# EAGLE design ansible (EAGLE 7.6.0)
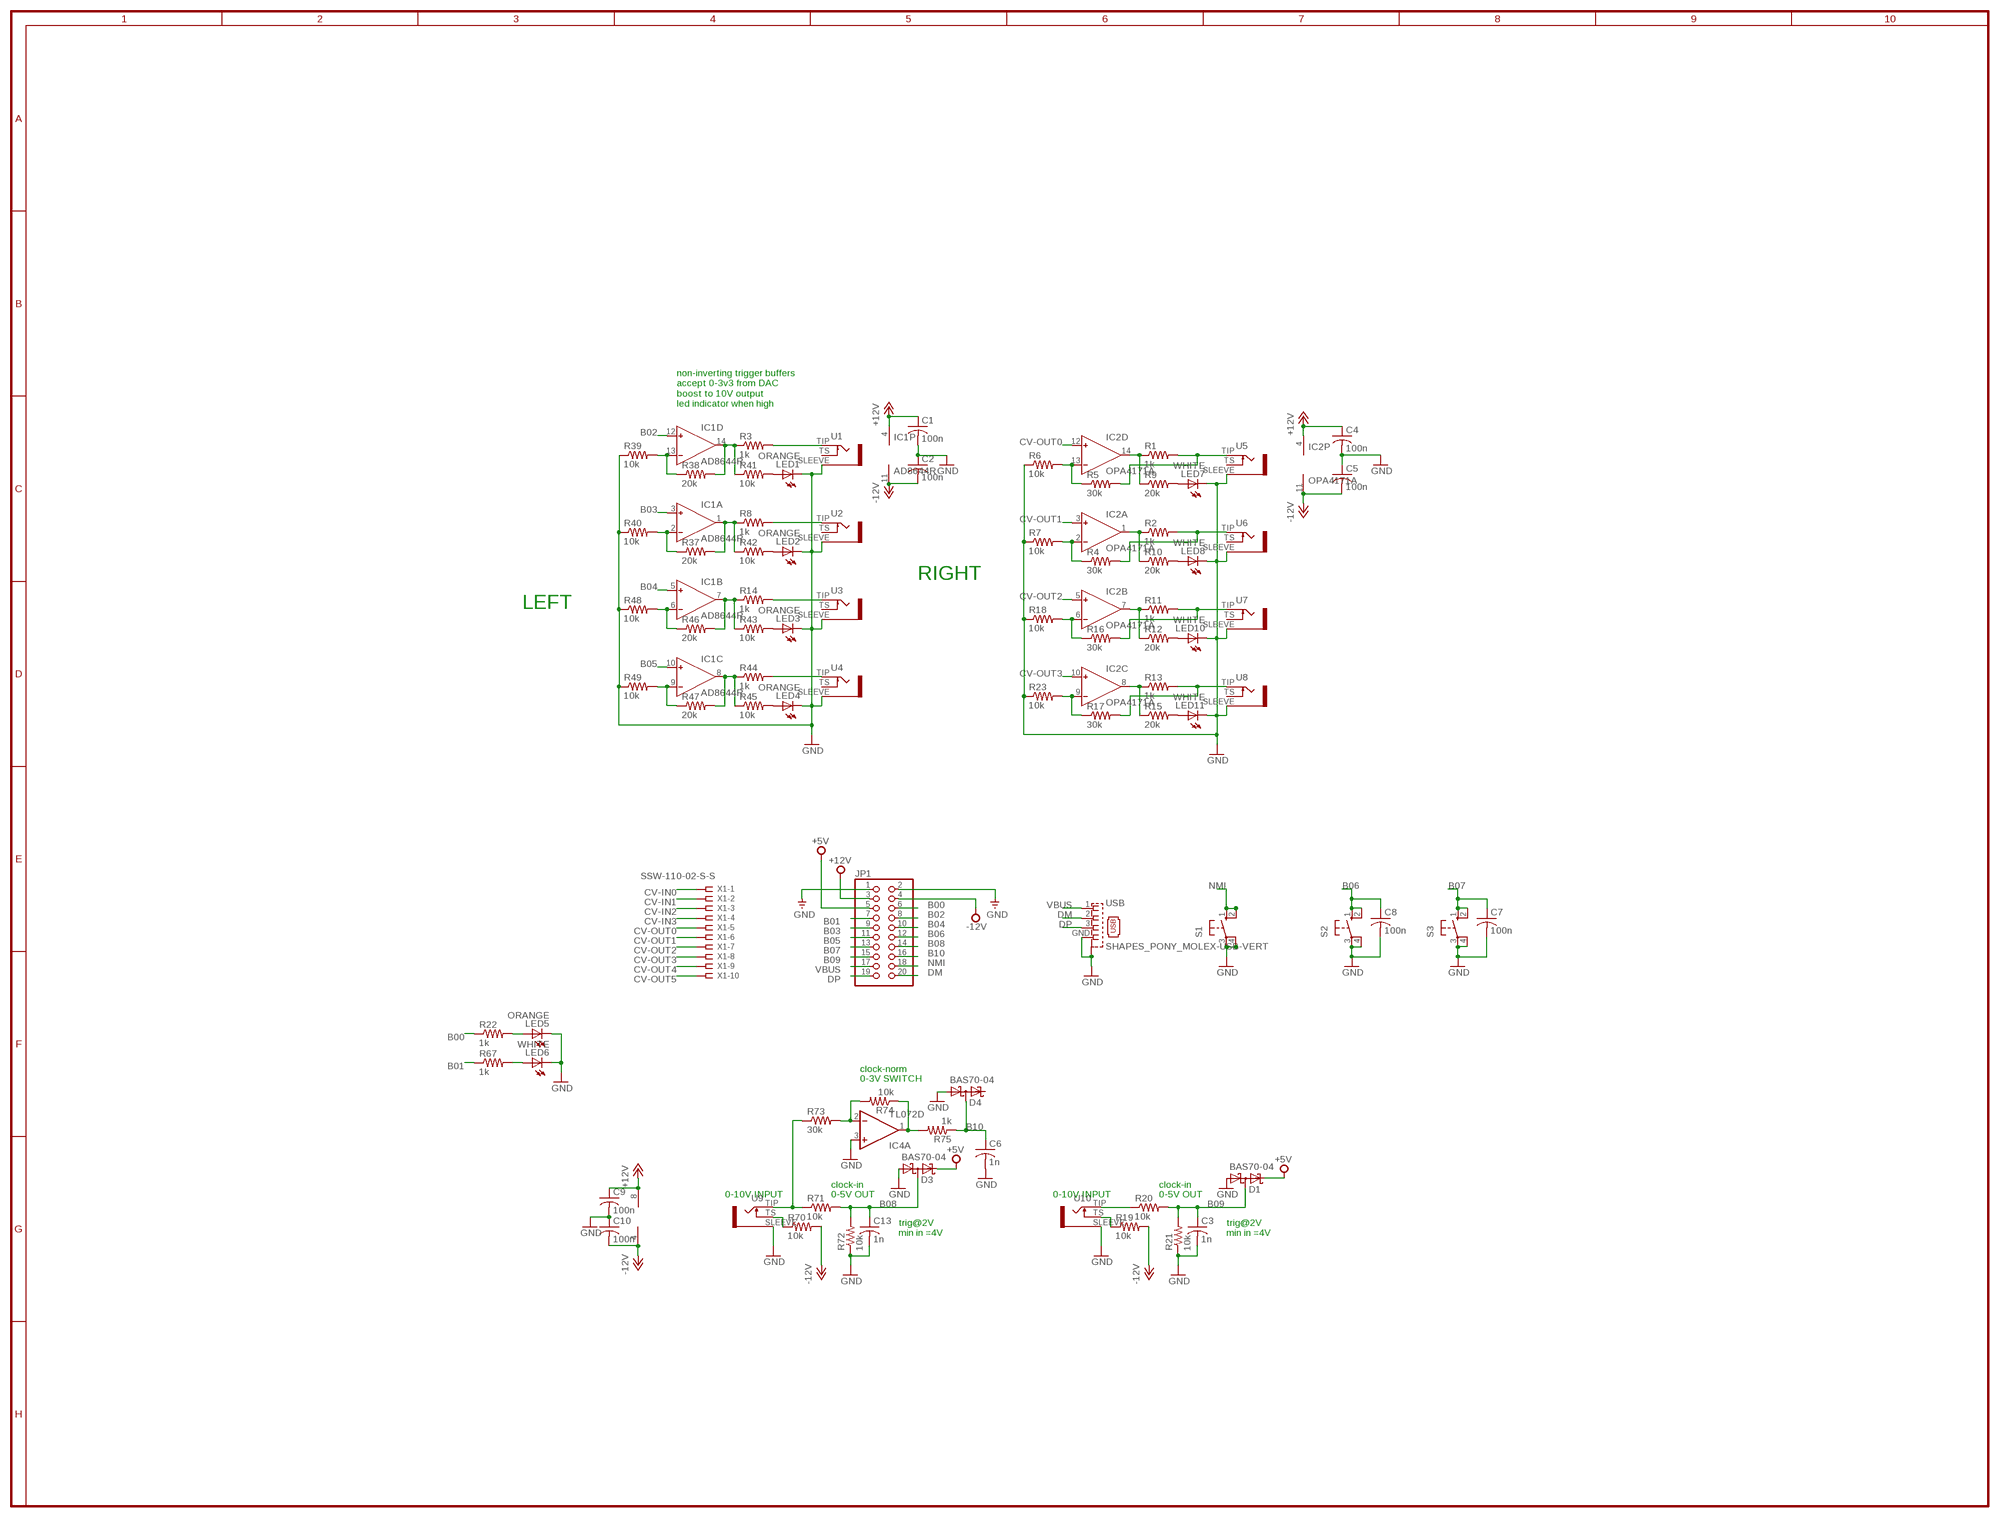
[diagram p0: schematic, sheet 1]

## Parts
C1  100n  C-USC0402  [C0402]
C2  100n  C-USC0402  [C0402]
C3  1n  C-USC0402  [C0402]
C4  100n  C-USC0402  [C0402]
C5  100n  C-USC0402  [C0402]
C6  1n  C-USC0402  [C0402]
C7  100n  C-USC0402  [C0402]
C8  100n  C-USC0402  [C0402]
C9  100n  C-USC0402  [C0402]
C10  100n  C-USC0402  [C0402]
C13  1n  C-USC0402  [C0402]
D1  BAS70-04  [SOT23]
D3  BAS70-04  [SOT23]
D4  BAS70-04  [SOT23]
IC1  AD8644R  [SO14]
IC2  OPA4171A  AD8644R  [SO14]
IC4  TL072D  [SO08]
JP1  PINHD-2X10  [2X10]
LED1  ORANGE  LEDCHIP-LED0603  [CHIP-LED0603]
LED2  ORANGE  LEDCHIP-LED0603  [CHIP-LED0603]
LED3  ORANGE  LEDCHIP-LED0603  [CHIP-LED0603]
LED4  ORANGE  LEDCHIP-LED0603  [CHIP-LED0603]
LED5  ORANGE  LEDCHIP-LED0603  [CHIP-LED0603]
LED6  WHITE  LEDCHIP-LED0603  [CHIP-LED0603]
LED7  WHITE  LEDCHIP-LED0603  [CHIP-LED0603]
LED8  WHITE  LEDCHIP-LED0603  [CHIP-LED0603]
LED10  WHITE  LEDCHIP-LED0603  [CHIP-LED0603]
LED11  WHITE  LEDCHIP-LED0603  [CHIP-LED0603]
R1  1k  R-US_R0402  [R0402]
R2  1k  R-US_R0402  [R0402]
R3  1k  R-US_R0402  [R0402]
R4  30k  R-US_R0402  [R0402]
R5  30k  R-US_R0402  [R0402]
R6  10k  R-US_R0402  [R0402]
R7  10k  R-US_R0402  [R0402]
R8  1k  R-US_R0402  [R0402]
R9  20k  R-US_R0402  [R0402]
R10  20k  R-US_R0402  [R0402]
R11  1k  R-US_R0402  [R0402]
R12  20k  R-US_R0402  [R0402]
R13  1k  R-US_R0402  [R0402]
R14  1k  R-US_R0402  [R0402]
R15  20k  R-US_R0402  [R0402]
R16  30k  R-US_R0402  [R0402]
R17  30k  R-US_R0402  [R0402]
R18  10k  R-US_R0402  [R0402]
R19  10k  R-US_R0402  [R0402]
R20  10k  R-US_R0402  [R0402]
R21  10k  R-US_R0402  [R0402]
R22  1k  R-US_R0402  [R0402]
R23  10k  R-US_R0402  [R0402]
R37  20k  R-US_R0402  [R0402]
R38  20k  R-US_R0402  [R0402]
R39  10k  R-US_R0402  [R0402]
R40  10k  R-US_R0402  [R0402]
R41  10k  R-US_R0402  [R0402]
R42  10k  R-US_R0402  [R0402]
R43  10k  R-US_R0402  [R0402]
R44  1k  R-US_R0402  [R0402]
R45  10k  R-US_R0402  [R0402]
R46  20k  R-US_R0402  [R0402]
R47  20k  R-US_R0402  [R0402]
R48  10k  R-US_R0402  [R0402]
R49  10k  R-US_R0402  [R0402]
R67  1k  R-US_R0402  [R0402]
R70  10k  R-US_R0402  [R0402]
R71  10k  R-US_R0402  [R0402]
R72  10k  R-US_R0402  [R0402]
R73  30k  R-US_R0402  [R0402]
R74  10k  R-US_R0402  [R0402]
R75  1k  R-US_R0402  [R0402]
S1  10-XX  [B3F-10XX]
S2  10-XX  [B3F-10XX]
S3  10-XX  [B3F-10XX]
U1  WQP-PJ301M-12_JACK  [WQP-PJ301M-12_JACK]
U2  WQP-PJ301M-12_JACK  [WQP-PJ301M-12_JACK]
U3  WQP-PJ301M-12_JACK  [WQP-PJ301M-12_JACK]
U4  WQP-PJ301M-12_JACK  [WQP-PJ301M-12_JACK]
U5  WQP-PJ301M-12_JACK  [WQP-PJ301M-12_JACK]
U6  WQP-PJ301M-12_JACK  [WQP-PJ301M-12_JACK]
U7  WQP-PJ301M-12_JACK  [WQP-PJ301M-12_JACK]
U8  WQP-PJ301M-12_JACK  [WQP-PJ301M-12_JACK]
U9  WQP-PJ301M-12_JACK  [WQP-PJ301M-12_JACK]
U10  WQP-PJ301M-12_JACK  [WQP-PJ301M-12_JACK]
USB  SHAPES_PONY_MOLEX-USB-VERT  [SHAPES_PONY_MOLEX-USB]
X1  SSW-110-02-S-S  [SSW-110-02-S-S]

## Nets
+5V: D1.2(C2) D3.2(C2) JP1.5
+12V: C1.1 C4.1 C9.1 IC1.4(P:V+) IC2.4(P:V+) IC4.8(P:V+) JP1.3
-12V: C2.2 C5.2 C10.2 IC1.11(P:V-) IC2.11(P:V-) IC4.4(P:V-) JP1.4 R19.2 R70.2
B00: JP1.6 R22.1
B01: JP1.7 R67.1
B02: IC1.12(D:IN+) JP1.8
B03: IC1.3(A:IN+) JP1.9
B04: IC1.5(B:IN+) JP1.10
B05: IC1.10(C:IN+) JP1.11
B06: C8.1 JP1.12 S2.1(S) S2.2(S1)
B07: C7.1 JP1.13 S3.1(S) S3.2(S1)
B08: C13.1 D3.3(C1A2) JP1.14 R71.2 R72.2
B09: C3.1 D1.3(C1A2) JP1.15 R20.2 R21.2
B10: C6.1 D4.3(C1A2) JP1.16 R75.1
CV-IN0: X1.1
CV-IN1: X1.2
CV-IN2: X1.3
CV-IN3: X1.4
CV-OUT0: IC2.12(D:IN+) X1.5
CV-OUT1: IC2.3(A:IN+) X1.6
CV-OUT2: IC2.5(B:IN+) X1.7
CV-OUT3: IC2.10(C:IN+) X1.8
CV-OUT4: X1.9
CV-OUT5: X1.10
DM: JP1.20 USB.2
DP: JP1.19 USB.3
GND: C1.2 C2.1 C3.2 C4.2 C5.1 C6.2 C7.2 C8.2 C9.2 C10.1 C13.2 D1.1(A1) D3.1(A1) D4.1(A1) IC4.3(A:+IN) JP1.1 JP1.2 LED1.C LED2.C LED3.C LED4.C LED5.C LED6.C LED7.C LED8.C LED10.C LED11.C R6.1 R7.1 R18.1 R21.1 R23.1 R39.1 R40.1 R48.1 R49.1 R72.1 S1.3(P) S1.4(P1) S2.3(P) S2.4(P1) S3.3(P) S3.4(P1) U1.SLEEVE U2.SLEEVE U3.SLEEVE U4.SLEEVE U5.SLEEVE U6.SLEEVE U7.SLEEVE U8.SLEEVE U9.SLEEVE U10.SLEEVE USB.GND USB.M1(S1) USB.M2(S1) USB.M4(S1)
N: IC4.1(A:OUT) R74.1 R75.2
N$1: IC4.2(A:-IN) R73.2 R74.2
N$2: IC1.14(D:OUT) R3.1 R38.2 R41.1
N$3: IC1.1(A:OUT) R8.1 R37.2 R42.1
N$4: IC1.7(B:OUT) R14.1 R43.1 R46.2
N$5: IC1.8(C:OUT) R44.1 R45.1 R47.2
N$6: R3.2 U1.TIP
N$7: R8.2 U2.TIP
N$8: R14.2 U3.TIP
N$9: R44.2 U4.TIP
N$10: R20.1 U10.TIP
N$11: IC2.14(D:OUT) R1.1 R9.1
N$12: IC2.1(A:OUT) R2.1 R10.1
N$13: IC2.7(B:OUT) R11.1 R12.1
N$14: IC2.8(C:OUT) R13.1 R15.1
N$15: LED5.A R22.2
N$19: R13.2 R17.2 U8.TIP
N$20: IC2.13(D:IN-) R5.1 R6.2
N$21: IC2.2(A:IN-) R4.1 R7.2
N$22: LED7.A R9.2
N$23: LED8.A R10.2
N$24: R70.1 U9.TS
N$25: R19.1 U10.TS
N$26: IC2.9(C:IN-) R17.1 R23.2
N$27: IC2.6(B:IN-) R16.1 R18.2
N$28: LED10.A R12.2
N$29: LED11.A R15.2
N$30: R1.2 R5.2 U5.TIP
N$31: R2.2 R4.2 U6.TIP
N$32: R11.2 R16.2 U7.TIP
N$57: IC1.9(C:IN-) R47.1 R49.2
N$58: IC1.6(B:IN-) R46.1 R48.2
N$61: R71.1 R73.1 U9.TIP
N$62: IC1.13(D:IN-) R38.1 R39.2
N$63: IC1.2(A:IN-) R37.1 R40.2
N$64: LED6.A R67.2
N$67: LED1.A R41.2
N$68: LED2.A R42.2
N$70: LED3.A R43.2
N$71: LED4.A R45.2
NMI: JP1.18 S1.1(S) S1.2(S1)
VBUS: JP1.17 USB.1
Unconnected: D4.2(C2) IC4.5(B:+IN) IC4.6(B:-IN) IC4.7(B:OUT) U1.TS U2.TS U3.TS U4.TS U5.TS U6.TS U7.TS U8.TS

## Notes on the sheet
- non-inverting trigger buffers
  accept 0-3v3 from DAC
  boost to 10V output
  led indicator when high
- RIGHT
- LEFT
- clock-norm
- 0-3V SWITCH
- clock-in | clock-in
- 0-10V INPUT | 0-5V OUT | 0-10V INPUT | 0-5V OUT
- trig@2V
  min in =4V
- trig@2V
  min in =4V

## Library data of the parts
C1-C10 C13 = rcl:C-US: CAPACITOR, American symbol
D1 D3 D4 = diode:BAS70-04: Silicon Schottky Diodes General-purpose diode for high-speed switching
IC1 IC2 = analog-devices:AD8644: Single and Quad 18 V Operational Amplifiers Source: http://www.analog.com/static/imported-files/data_sheets/AD8614_8644.pdf; MF: ALTERA CORPORATION; MPN: AD8644ARZ; OC_FARNELL: 1438873; OC_NEWARK: 59K7037
IC4 = linear:TL072: OP AMP
JP1 = pinhead:PINHD-2X10: PIN HEADER
LED1-LED8 LED10 LED11 = led:LED: LED OSRAM: - CHIPLED LG R971, LG N971, LY N971, LG Q971, LY Q971, LO R971, LY R971 LH N974, LH R974 LS Q976, LO Q976, LY Q976 LO Q996 - Hyper CHIPLED LW Q18S LB Q993, LB Q99A, LB R99A - SideLED LS A670, LO A670, LY A670, LG A670, LP A670 LB A673, LV A673, LT A673, LW A673 LH A674 LY A675 LS A676, LA A676, LO A676, LY A676, LW A676 LS A679, LY A679, LG A679 - Hyper Micro SIDELED® LS Y876, LA Y876, LO Y876, LY Y876 LT Y87S - SmartLED LW L88C, LW L88S LB L89C, LB L89S, LG L890 LS L89K, LO L89K, LY L89K LS L896, LA L896, LO L896, LY L896 - TOPLED LS T670, LO T670, LY T670, LG T670, LP T670 LSG T670, LSP T670, LSY T670, LOP T670, LYG T670 LG T671, LOG T671, LSG T671 LB T673, LV T673, LT T673, LW T673 LH T674 LS T676, LA T676, LO T676, LY T676, LB T676, LH T676, LSB T676, LW T676 LB T67C, LV T67C, LT T67C, LS T67K, LO T67K, LY T67K, LW E67C LS E67B, LA E67B, LO E67B, LY E67B, LB E67C, LV E67C, LT E67C LW T67C LS T679, LY T679, LG T679 LS T770, LO T770, LY T770, LG T770, LP T770 LB T773, LV T773, LT T773, LW T773 LH T774 LS E675, LA E675, LY E675, LS T675 LS T776, LA T776, LO T776, LY T776, LB T776 LHGB T686 LT T68C, LB T68C - Hyper Mini TOPLED® LB M676 - Mini TOPLED Santana® LG M470 LS M47K, LO M47K, LY M47K Source: http://www.osram.convergy.de LUXEON: - LUMILED® LXK2-PW12-R00, LXK2-PW12-S00, LXK2-PW14-U00, LXK2-PW14-V00 LXK2-PM12-R00, LXK2-PM12-S00, LXK2-PM14-U00 LXK2-PE12-Q00, LXK2-PE12-R00, LXK2-PE12-S00, LXK2-PE14-T00, LXK2-PE14-U00 LXK2-PB12-K00, LXK2-PB12-L00, LXK2-PB12-M00, LXK2-PB14-N00, LXK2-PB14-P00, LXK2-PB14-Q00 LXK2-PR12-L00, LXK2-PR12-M00, LXK2-PR14-Q00, LXK2-PR14-R00 LXK2-PD12-Q00, LXK2-PD12-R00, LXK2-PD12-S00 LXK2-PH12-R00, LXK2-PH12-S00 LXK2-PL12-P00, LXK2-PL12-Q00, LXK2-PL12-R00 Source: www.luxeon.com KINGBRIGHT: KA-3528ASYC Source: www.kingbright.com
R1-R23 R37-R49 R67 R70-R75 = rcl:R-US_: RESISTOR, American symbol
S1-S3 = switch-omron:10-XX: OMRON SWITCH; MPN: B3F-1000; OC_FARNELL: 176432; OC_NEWARK: 36M3542
U1-U10 = thonkiconn:WQP-PJ301M-12_JACK
USB = monome_modular:SHAPES_PONY_MOLEX-USB-VERT
X1 = con-samtec:SSW-110-02-S-S: THROUGH-HOLE .025" SQ POST SOCKET Source: Samtec SSW.pdf; MPN: SSW-110-02-S-S; OC_FARNELL: unknown; OC_NEWARK: 11P9482

## Board
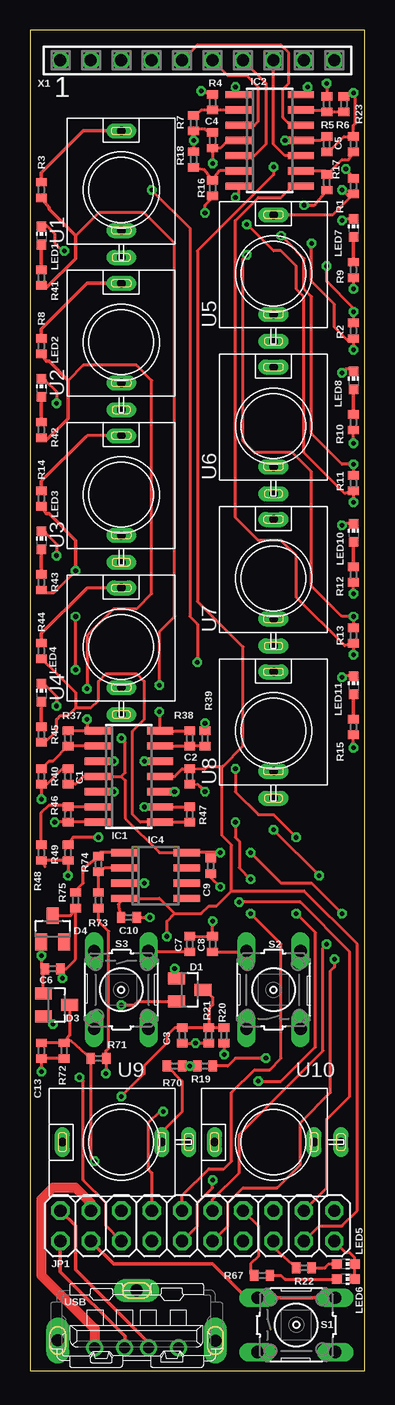
[diagram p1: board, top side]
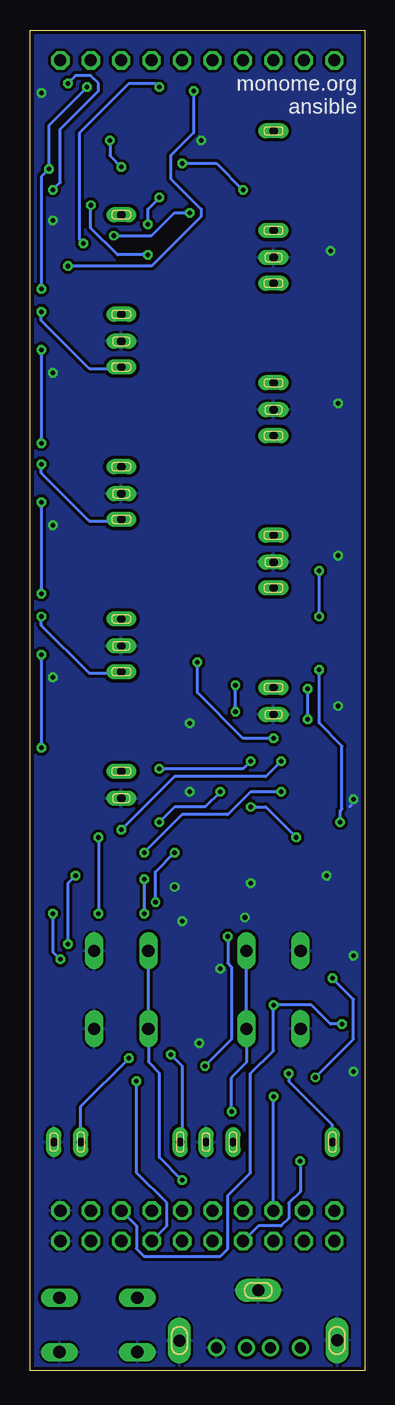
[diagram p2: board, bottom side, seen from below]

Size 27.94 x 111.76 mm. Coordinates in mm from the lower left corner, seen from the top.
Outline: 0,0 27.94,0 27.94,111.76 0,111.76 0,0
Copper layers (1*16): Top 0.035mm / dielectric 1.5mm / Bottom 0.035mm
Design rules "default *": minimum track width 10mil, minimum drill 15mil, track to track 6mil, track to pad 6mil, pad to pad 6mil, via to via 6mil, smd to smd 0mil, copper to edge 12mil, drill to drill 8mil, minimum pad ring 10mil, minimum via ring 8mil, stop-mask expansion 4mil, vias tented up to drill 0mil, thermal gap 8mil

### Footprints (pad centres in the part's own frame; a part is rotated, then mirrored left to right if it is on the bottom)
C0402 = smd 0.7 x 0.9: 1 -0.65,0; 2 0.65,0
SOT23 = smd 1 x 1.4: 1 -0.95,-1.1; 2 0.95,-1.1; 3 0,1.1
SO14 = smd 0.6 x 2.2: 1 -3.81,-2.6; 2 -2.54,-2.6; 3 -1.27,-2.6; 4 0,-2.6; 5 1.27,-2.6; 6 2.54,-2.6; 7 3.81,-2.6; 8 3.81,2.6; 9 2.54,2.6; 10 1.27,2.6; 11 0,2.6; 12 -1.27,2.6; 13 -2.54,2.6; 14 -3.81,2.6
SO08 = smd 0.6 x 2.2: 1 -1.905,-2.6; 2 -0.635,-2.6; 3 0.635,-2.6; 4 1.905,-2.6; 5 1.905,2.6; 6 0.635,2.6; 7 -0.635,2.6; 8 -1.905,2.6
2X10 = drill 1.016 octagon: 1 -11.43,-1.27; 2 -11.43,1.27; 3 -8.89,-1.27; 4 -8.89,1.27; 5 -6.35,-1.27; 6 -6.35,1.27; 7 -3.81,-1.27; 8 -3.81,1.27; 9 -1.27,-1.27; 10 -1.27,1.27; 11 1.27,-1.27; 12 1.27,1.27; 13 3.81,-1.27; 14 3.81,1.27; 15 6.35,-1.27; 16 6.35,1.27; 17 8.89,-1.27; 18 8.89,1.27; 19 11.43,-1.27; 20 11.43,1.27
CHIP-LED0603 = smd 0.8 x 0.8: A 0,-0.75; C 0,0.75
R0402 = smd 0.7 x 0.9: 1 -0.65,0; 2 0.65,0
B3F-10XX = drill 1.016 long: 1 -3.251,2.261; 2 3.251,2.261; 3 -3.251,-2.261; 4 3.251,-2.261
WQP-PJ301M-12_JACK = drill 0.7 pad 1.27 long: SLEEVE 0,-5.63; TIP 0,4.92; TS 0,-3.38
SHAPES_PONY_MOLEX-USB = drill 0.9 pad 1.3: 1 -3.5,-1.9; 2 -1,-1.9; 3 1,-1.9; GND 3.5,-1.9 | drill 1 pad 1.9 long: M1 -6.575,-1.295; M2 6.575,-1.305; M4 0,2.88
SSW-110-02-S-S = drill 1 pad 1.5 octagon: 1 -11.43,0; 2 -8.89,0; 3 -6.35,0; 4 -3.81,0; 5 -1.27,0; 6 1.27,0; 7 3.81,0; 8 6.35,0; 9 8.89,0; 10 11.43,0

### Placement (x,y rotation side)
C1  3.17,49.53 90 top
C2  13.34,49.53 90 top
C3  12.7,27.94 270 top
C4  15.24,102.55 90 top
C5  24.77,102.23 90 top
C6  1.91,33.5 180 top
C7  13.34,35.56 90 top
C8  15.24,35.56 90 top
C9  15.08,42.07 270 top
C10  8.26,37.78 180 top
C13  0.95,26.67 270 top
D1  13.34,31.75 270 top
D3  2.22,30.48 270 top
D4  1.91,36.83 0 top
IC1  8.26,49.53 270 top
IC2  20,102.55 270 top
IC4  10.48,41.27 270 top
JP1  13.97,12.06 180 top
LED1  0.95,94.61 0 top
LED2  0.95,81.92 0 top
LED3  0.95,69.22 0 top
LED4  0.95,56.52 0 top
LED5  26.35,8.89 270 top
LED6  26.35,7.62 270 top
LED7  26.99,95.25 0 top
LED8  26.99,82.55 0 top
LED10  26.99,69.85 0 top
LED11  26.99,57.15 0 top
R1  26.99,98.74 270 top
R2  26.99,86.68 90 top
R3  0.95,98.42 90 top
R4  15.24,105.73 90 top
R5  24.77,105.57 90 top
R6  26.19,105.57 270 top
R7  13.65,103.98 90 top
R8  0.95,85.41 90 top
R9  26.99,91.76 90 top
R10  26.99,79.06 90 top
R11  26.99,73.98 90 top
R12  26.99,66.36 90 top
R13  26.99,61.28 90 top
R14  0.95,72.71 90 top
R15  26.99,53.66 90 top
R16  15.24,98.58 270 top
R17  24.77,99.06 270 top
R18  13.65,100.97 270 top
R19  14.61,25.4 180 top
R20  16.19,27.94 90 top
R21  14.92,27.94 90 top
R22  22.86,8.57 0 top
R23  26.99,102.23 270 top
R37  3.17,52.7 90 top
R38  13.34,52.7 90 top
R39  14.61,52.7 270 top
R40  0.95,49.53 90 top
R41  0.95,91.12 90 top
R42  0.95,78.42 90 top
R43  0.95,65.72 90 top
R44  0.95,60.01 90 top
R45  0.95,53.02 90 top
R46  3.17,46.35 270 top
R47  13.34,46.35 270 top
R48  0.95,43.18 90 top
R49  3.17,43.18 90 top
R67  19.37,7.94 0 top
R70  12.06,25.4 0 top
R71  5.71,26.04 180 top
R72  2.86,26.67 90 top
R73  5.71,39.21 90 top
R74  5.71,42.23 270 top
R75  3.81,39.21 90 top
S1  22.23,3.81 0 top
S2  20.32,31.75 90 top
S3  7.62,31.75 270 top
U1  7.62,98.42 0 top
U2  7.62,85.72 0 top
U3  7.62,73.03 0 top
U4  7.62,60.33 0 top
U5  20.32,91.44 0 top
U6  20.32,78.74 0 top
U7  20.32,66.04 0 top
U8  20.32,53.34 0 top
U9  7.62,19.05 90 top
U10  20.32,19.05 90 top
USB  8.89,3.81 0 top
X1  13.97,109.22 0 top

### Tracks (layer width: path | path; a pad name or v marks a point on that pad's centre or on a via)
+5V  (via drill 0.38)
  Top 0.254: D3.2 1.12,29.38 v1.91,28.89 | v7.62,30.48 8.73,30.48 9.05,30.8 D1.2
  Bottom 0.254: v1.91,28.89 2.86,28.89 4.45,30.48 v7.62,30.48 7.62,26.67 9.53,24.77 9.53,16.51 11.43,14.61 11.43,10.16 12.06,9.53 18.41,9.53 19.05,10.16 19.05,12.06 JP1.5
+12V  (via drill 0.38)
  Top 0.254: IC2.4 16.51,102.55 15.88,101.92 15.46,101.92 C4.1 v15.24,100.65 | v10.16,98.42 13.34,95.25 13.34,62.87 13.97,62.23 v13.97,59.05 | C9.1 14.87,42.92 14.61,43.18 | 14.61,43.18 IC4.8 10.79,43.18 7.94,46.04 7.94,49.21 7.62,49.53 | 7.62,49.53 IC1.4 4.45,49.53 3.81,48.9 3.19,48.9 C1.1 | 7.62,49.53 7.94,49.85 7.94,52.39 v7.62,52.7 | JP1.3 24.77,15.24 24.77,20.95 26.67,22.86 26.67,34.92 22.54,39.05 v17.46,39.05 | v15.88,43.18 14.61,43.18
  Bottom 0.254: v15.24,100.65 12.38,100.65 v10.16,98.42 | v7.62,52.7 10.16,52.7 13.97,56.52 v13.97,59.05 | v17.46,39.05 17.46,41.59 v15.88,43.18
-12V  (via drill 0.38)
  Top 0.254: IC1.11 12.06,49.53 12.7,50.16 13.12,50.16 C2.2 14.61,50.16 14.82,50.38 16.03,50.38 | C5.2 24.23,102.55 IC2.11 v21.27,102.55 | v20.32,100.33 20.32,99.69 13.97,93.34 13.97,64.14 17.78,60.33 17.78,52.07 16.09,50.38 16.03,50.38 | C10.2 7.41,38.9 IC4.4 10.79,39.37 12.06,38.1 | 12.06,38.1 14.29,38.1 14.92,38.73 15.56,38.73 16.83,40.01 | 16.83,40.01 16.83,43.81 16.03,44.61 16.03,50.38 | JP1.4 24.13,12.06 26.04,12.06 27.3,13.34 27.3,35.56 22.86,40.01 16.83,40.01 | v11.43,36.2 11.43,37.47 12.06,38.1 | R19.2 v13.34,25.4 R70.2
  Bottom 0.254: v21.27,102.55 21.27,101.28 v20.32,100.33 | v11.43,36.2 11.43,33.97 11.11,33.66 11.11,27.62 v13.34,25.4
B00
  Top 0.254: JP1.6 20.42,10.16 R22.1
B01
  Top 0.254: JP1.7 19.05,12.06 19.05,9.53 18.41,8.89 18.41,8.04 R67.1
B02  (via drill 0.38)
  Top 0.254: IC1.12 v9.53,50.8 | v17.14,50.16 17.14,48.26 19.05,46.35 20.32,46.35 v22.23,44.45 | v19.05,24.13 20.95,24.13 23.81,26.99 23.81,36.51 v22.23,38.1
  Bottom 0.254: v9.53,50.8 10.16,50.16 v17.14,50.16 | JP1.8 16.51,12.06 16.51,13.97 19.05,16.51 v19.05,24.13 | v22.23,44.45 v22.23,38.1
B03  (via drill 0.38)
  Top 0.254: IC1.3 v6.99,50.8 | JP1.9 15.24,14.29 17.46,16.51 17.46,19.68 24.45,26.67 24.45,35.24 v24.77,35.56 | v20.32,45.09 v24.13,41.27
  Bottom 0.254: v6.99,50.8 8.26,49.53 15.88,49.53 v20.32,45.09 | v24.77,35.56 24.77,40.64 v24.13,41.27
B04  (via drill 0.38)
  Top 0.254: IC1.5 v6.99,48.26 | JP1.10 16.51,12.06 16.51,13.97 17.78,15.24 20.64,15.24 22.54,17.14 22.54,20.64 25.08,23.18 25.08,33.34 25.4,33.66 v25.4,34.29 | v18.41,43.18 20.95,40.64 23.5,40.64 v26.04,38.1
  Bottom 0.254: v6.99,48.26 9.53,48.26 11.43,46.35 15.24,46.35 v18.41,43.18 | v26.04,38.1 26.04,34.92 v25.4,34.29
B05  (via drill 0.38)
  Top 0.254: IC1.10 v12.06,48.26 | JP1.11 12.7,14.61 14.92,16.83 16.19,16.83 16.83,17.46 16.83,23.18 18.73,25.08 20,25.08 20.95,26.04 20.95,35.56 v18.41,38.1 | v17.14,45.72 17.14,44.45 17.46,44.13 17.46,41.91 v18.41,40.96
  Bottom 0.254: v12.06,48.26 13.34,46.99 15.88,46.99 v17.14,45.72 | v18.41,40.96 v18.41,38.1
B06  (via drill 0.38)
  Top 0.254: JP1.12 13.97,12.06 13.97,13.97 15.24,15.24 v15.24,15.88 | C8.1 17.97,34.91 S2.2
  Bottom 0.254: S2.2 S2.1 18.06,25.76 17.14,24.77 17.14,17.78 v15.24,15.88
B07  (via drill 0.38)
  Top 0.254: v11.11,21.59 10.79,21.59 9.84,20.64 9.84,16.83 10.16,16.51 JP1.13 | C7.1 9.97,34.91 S3.1
  Bottom 0.254: S3.1 S3.2 9.88,25.68 11.11,24.45 v11.11,21.59
B08  (via drill 0.38)
  Top 0.254: R72.2 C13.1 | D3.3 3.32,27.98 R72.2 | R72.2 3.38,27.52 R71.2 5.08,26.02 5.08,17.78 v5.4,17.46
  Bottom 0.254: v5.4,17.46 5.4,14.92 6.35,13.97 6.35,12.7 6.99,12.06 8.89,12.06 JP1.14
B09  (via drill 0.38)
  Top 0.254: R21.2 C3.1 12.08,28.59 11.43,27.94 11.43,27.3 9.53,25.4 9.53,24.77 v7.62,22.86 | D1.3 14.61,31.75 15.24,31.11 15.24,30.48 14.92,30.16 R21.2 | R20.2 R21.2
  Bottom 0.254: JP1.15 v7.62,22.86
B10  (via drill 0.38)
  Top 0.254: D4.3 3.38,37.93 R75.1 3.81,34.29 3.02,33.5 C6.1 2.7,33.44 v2.7,32.7 | JP1.16 6.35,12.06 6.35,13.97 4.45,15.88 4.45,24.13 v4.13,24.45
  Bottom 0.254: v4.13,24.45 0.95,27.62 0.95,30.96 v2.7,32.7
CV-OUT0
  Top 0.254: IC2.12 21.75,103.82 21.11,104.46 21.11,106.84 21.59,107.31 21.59,109.86 20.95,110.49 13.97,110.49 X1.5
CV-OUT1
  Top 0.254: IC2.3 18.73,103.82 19.05,104.14 19.05,107 18.1,107.95 16.51,107.95 X1.6
CV-OUT2
  Top 0.254: X1.7 19.68,107.31 19.68,102.23 18.73,101.28 IC2.5
CV-OUT3
  Top 0.254: IC2.10 21.27,101.28 20.32,102.23 X1.8
DM
  Top 0.305: JP1.20 2.54,8.26 7.94,2.86 7.94,1.96 USB.2
DP
  Top 0.305: JP1.19 3.81,12.06 3.81,8.41 9.84,2.38 9.84,1.96 USB.3
GND  (via drill 0.38)
  Top 0.254: 1.27,42.01 R48.1 R49.1 v3.17,41.27 | C2.1 13.97,48.9 14.19,48.68 14.23,48.68 v14.61,48.26 | C1.2 2.96,50.16 2.7,50.16 1.21,48.68 R40.1 v0.95,47.62 | LED4.C 0.85,57.56 2.22,56.2 v2.22,55.4 | LED3.C 1.17,70.27 1.27,69.85 2.22,68.9 v2.22,67.94 | LED2.C 1.17,82.97 1.27,82.55 2.22,81.6 v2.22,80.64 | LED1.C 1.17,95.67 2.06,94.77 2.06,93.98 2.7,93.34 v2.86,93.34 | LED8.C 26.99,83.5 26.35,83.5 v26.04,83.19 | R6.1 26.89,106.42 v26.99,106.52 27.15,106.36 27.15,103.98 26.99,103.82 R23.1 26.77,102.87 26.19,102.87 24.77,101.44 C5.1 | LED6.C LED5.C 27.1,9.41 26.67,9.84 26.35,9.84 JP1.2 | C4.2 14.91,103.2 14.61,103.5 13.97,103.5 13.92,103.4 R7.1 v13.65,102.55 R18.1 13.44,101.6 | IC4.3 v9.53,40.64 | C9.2 15.08,41.12 v15.88,40.32 | 9.21,37.78 C10.1 v10,37.78 | D3.1 1.12,33.43 C6.2 0.95,33.6 v0.95,34.61 D4.1 | v0.95,24.92 C13.2 R72.1 | D1.1 12.23,33.33 v12.06,33.5 | v15.24,37.47 C8.2 C7.2 | C3.2 13.8,27.29 v13.81,27.3 13.83,27.29 R21.1 | R39.1 v14.61,53.98 | LED11.C 26.15,57.9 v26.04,57.78 | LED10.C 26.15,70.6 v26.04,70.48 | LED7.C 26.15,96 v26.04,95.89
  Bottom 0.254: 1.11,47.15 1.27,46.99
  pour Bottom (isolate 0.254): 0,0 27.94,0 27.94,111.76 0,111.76
N
  Top 0.254: R75.2 3.87,40.06 4.45,40.64 4.45,41.81 R74.1 5.82,43.18 IC4.1
N$1
  Top 0.254: IC4.2 6.25,41.91 R74.2 R73.2
N$2  (via drill 0.38)
  Top 0.254: R38.2 13.12,53.34 IC1.14 10.79,53.4 v10.79,54.93 | v10.79,57.15 10.79,61.59 12.06,62.87 12.06,93.98 9.53,96.52 5.71,96.52 3.81,94.61
  Top 0.305: R41.1 1.37,90.27 3.81,92.71 3.81,94.61 1.59,96.84 1.59,96.94 R3.1
  Bottom 0.254: v10.79,54.93 v10.79,57.15
N$3  (via drill 0.38)
  Top 0.254: IC1.1 5.08,53.34 | 5.08,53.34 3.39,53.34 R37.2 | v4.76,56.83 4.76,61.28 6.99,63.5 8.89,63.5 10.16,64.77 10.16,82.55 8.89,83.82 4.45,83.82 3.17,82.55 | v4.76,54.29 4.76,53.66 5.08,53.34
  Top 0.305: R42.1 1.37,77.57 3.17,79.38 3.17,82.55 1.59,84.14 1.37,84.14 R8.1
  Bottom 0.254: v4.76,54.29 v4.76,56.83
N$4  (via drill 0.38)
  Top 0.254: IC1.7 3.39,45.72 | 3.39,45.72 R46.2 | 3.39,45.72 v2.06,45.72 | v3.81,58.42 v3.81,62.87 | 1.37,64.87 2.01,64.87 v3.81,66.67
  Top 0.305: R43.1 1.37,64.87 | v3.81,66.67 3.81,69.22 1.59,71.44 1.37,71.44 R14.1
  Bottom 0.254: v2.06,45.72 2.06,46.67 1.91,46.83 1.91,52.07 3.81,53.98 v3.81,58.42 | v3.81,62.87 v3.81,66.67
N$5
  Top 0.254: R47.2 13.12,45.72 IC1.8 9.21,45.72 8.57,46.35 8.57,53.34 9.53,54.29 9.53,57.47 8.89,58.1 6.35,58.1 5.71,57.47 5.71,55.88 5.08,55.24 3.81,55.24 | 3.81,55.24 3.81,56.52 1.59,58.74 1.57,58.74 R44.1 | 3.81,55.24 3.17,54.61 2.54,54.61 2.22,54.29 2.22,53.34 1.27,52.39 1.17,52.17 R45.1
  Top 0.305: R45.1 1.05,52.49
N$6
  Top 0.305: R3.2 0.95,99.85 4.32,103.22 4.44,103.34 U1.TIP
N$7
  Top 0.305: R8.2 0.95,86.84 4.37,90.25 4.64,90.53 4.76,90.64 U2.TIP
N$8
  Top 0.254: U3.TIP 4.76,77.94 4.64,77.83
  Top 0.305: 4.64,77.83 0.95,74.14 R14.2
N$9
  Top 0.254: U4.TIP 4.76,65.25 4.64,65.12
  Top 0.305: 4.64,65.12 0.95,61.44 R44.2
N$10  (via drill 0.38)
  Top 0.254: R20.1 v16.19,26.35
  Bottom 0.254: v16.19,26.35 15.24,25.4 15.24,19.21 U10.TIP
N$11  (via drill 0.38)
  Top 0.254: R9.1 v26.99,90.17 | R1.1 26.93,99.59 v26.35,100.17 | v23.18,107 23.18,106.94 IC2.14
  Bottom 0.254: v26.99,90.17 26.99,99.54 v26.35,100.17 26.35,103.82 v23.18,107
N$12  (via drill 0.38)
  Top 0.254: v26.99,85.09 R2.1 26.57,85.83 25.4,87 25.4,88.9 23.5,90.81 v23.5,93.98 | v26.99,77.31 R10.1 | v17.14,107 17.14,106.62 IC2.1
  Bottom 0.254: v26.99,77.31 v26.99,85.09 26.99,85.41 | v23.5,93.98 23.81,94.3 23.81,103.19 19.68,107.31 17.46,107.31 v17.14,107
N$13  (via drill 0.38)
  Top 0.254: v26.99,72.39 R11.1 26.25,73.13 22.86,76.52 22.86,89.53 22.23,90.17 22.23,92.08 20.95,93.34 20.32,93.34 v18.1,95.57 | v26.99,64.77 R12.1 | IC2.7 17.4,98.05 v17.14,97.79
  Bottom 0.254: v26.99,72.39 v26.99,64.77 | v18.1,95.57 18.1,96.84 v17.14,97.79
N$14  (via drill 0.38)
  Top 0.254: v26.99,59.69 R13.1 26.25,60.43 22.23,64.45 22.23,67.94 20.95,69.22 19.05,69.22 17.14,71.12 17.14,95.89 19.05,97.79 20.95,97.79 21.91,98.68 IC2.8 | v26.99,51.91 R15.1
  Bottom 0.254: v26.99,59.69 v26.99,51.91
N$15
  Top 0.254: R22.2 24.61,8.57 24.92,8.89 LED5.A
N$19  (via drill 0.38)
  Top 0.254: R13.2 v26.99,62.87 26.04,62.87 23.5,65.41 23.5,74.93 21.91,76.52 18.73,76.52 17.78,77.47 17.78,92.71 v18.1,93.03 | v22.86,97.16 23.71,97.16 R17.2
  Bottom 0.254: v26.99,62.87 26.99,62.13 23,58.14 20.44,58.14 U8.TIP | v18.1,93.03 20.64,93.03 22.86,95.25 v22.86,97.16
N$20
  Top 0.254: R6.2 R5.1 24.39,105.09 IC2.13
N$21
  Top 0.254: IC2.2 15.46,105.09 R4.1 14.27,105.08 13.97,104.78 13.7,104.56 R7.2
N$22
  Top 0.305: LED7.A R9.2
N$23
  Top 0.305: LED8.A R10.2
N$24
  Top 0.254: R70.1 11.43,25.4 12.7,24.13 12.7,21.59 11,19.89 U9.TS
N$25  (via drill 0.38)
  Top 0.254: v19.68,26.04 17.14,26.04 16.51,25.4 R19.1
  Bottom 0.254: v19.68,26.04 23.7,22.02 U10.TS
N$26
  Top 0.254: R23.2 26.57,100.97 26.04,100.97 24.98,99.91 R17.1 24.66,100.01 IC2.9
N$27
  Top 0.254: R18.2 14.56,100.11 R16.1 15.82,100.01 IC2.6
N$28
  Top 0.305: LED10.A R12.2
N$29
  Top 0.305: LED11.A R15.2
N$30  (via drill 0.38)
  Top 0.254: v26.04,98.42 26.57,97.89 R1.2 25.25,96.36 U5.TIP | v24.77,107.31 R5.2
  Bottom 0.254: v26.04,98.42 25.4,99.06 25.4,103.5 22.23,106.68 22.23,107.31 22.86,107.95 24.13,107.95 v24.77,107.31
N$31  (via drill 0.38)
  Top 0.254: R2.2 v26.99,88.27 26.99,88.58 24.77,90.81 v24.77,92.08 | R4.2 14.39,106.58 v14.29,106.68
  Bottom 0.254: v26.99,88.27 26.99,87.53 23,83.54 20.44,83.54 U6.TIP | v14.29,106.68 14.29,103.19 16.19,101.28 16.19,99.38 13.65,96.84 13.65,96.2 17.78,92.08 v24.77,92.08
N$32  (via drill 0.38)
  Top 0.254: R11.2 v26.99,75.56 26.04,75.56 23.5,78.11 23.5,89.53 22.86,90.17 22.86,92.71 21.59,93.98 v20.95,94.61 | v14.61,96.52 14.61,97.16 15.24,97.79 15.18,97.79 R16.2
  Bottom 0.254: v26.99,75.56 26.99,74.83 23,70.84 20.44,70.84 U7.TIP | v20.95,94.61 17.78,94.61 15.88,96.52 v14.61,96.52
N$57  (via drill 0.38)
  Top 0.254: R47.1 13.12,46.99 IC1.9 v9.53,46.99 | v5.71,44.45 3.6,44.45 R49.2
  Bottom 0.254: v9.53,46.99 8.26,46.99 v5.71,44.45
N$58
  Top 0.254: IC1.6 3.39,46.99 R46.1 3.12,47.15 1.59,47.15 0.95,46.51 R48.2
N$61  (via drill 0.38)
  Top 0.254: R73.1 5.71,37.47 6.57,36.62 6.57,26.89 6.35,26.67 R71.1 6.37,24.78 v6.35,24.77
  Bottom 0.254: v6.35,24.77 6.35,24.13 2.7,20.48 U9.TIP
N$62
  Top 0.254: IC1.13 13.12,52.07 R38.1 R39.2
N$63
  Top 0.254: IC1.2 3.39,52.07 R37.1 1.91,50.8 1.57,50.8 R40.2
N$64
  Top 0.254: R67.2 20.95,7.94 21.27,7.62 LED6.A
N$67
  Top 0.305: LED1.A R41.2
N$68
  Top 0.305: LED2.A R42.2
N$70
  Top 0.305: LED3.A R43.2
N$71
  Top 0.305: LED4.A R45.2
NMI
  Top 0.305: S1.2 S1.1 18.06,6.07 15.24,8.89 6.99,8.89 JP1.18
VBUS
  Top 0.813: JP1.17 5.08,13.97 3.81,15.24 1.91,15.24 0.95,14.29 0.95,7.94 5.4,3.49 USB.1

### Text on the board
bPlace: monome.org / ansible